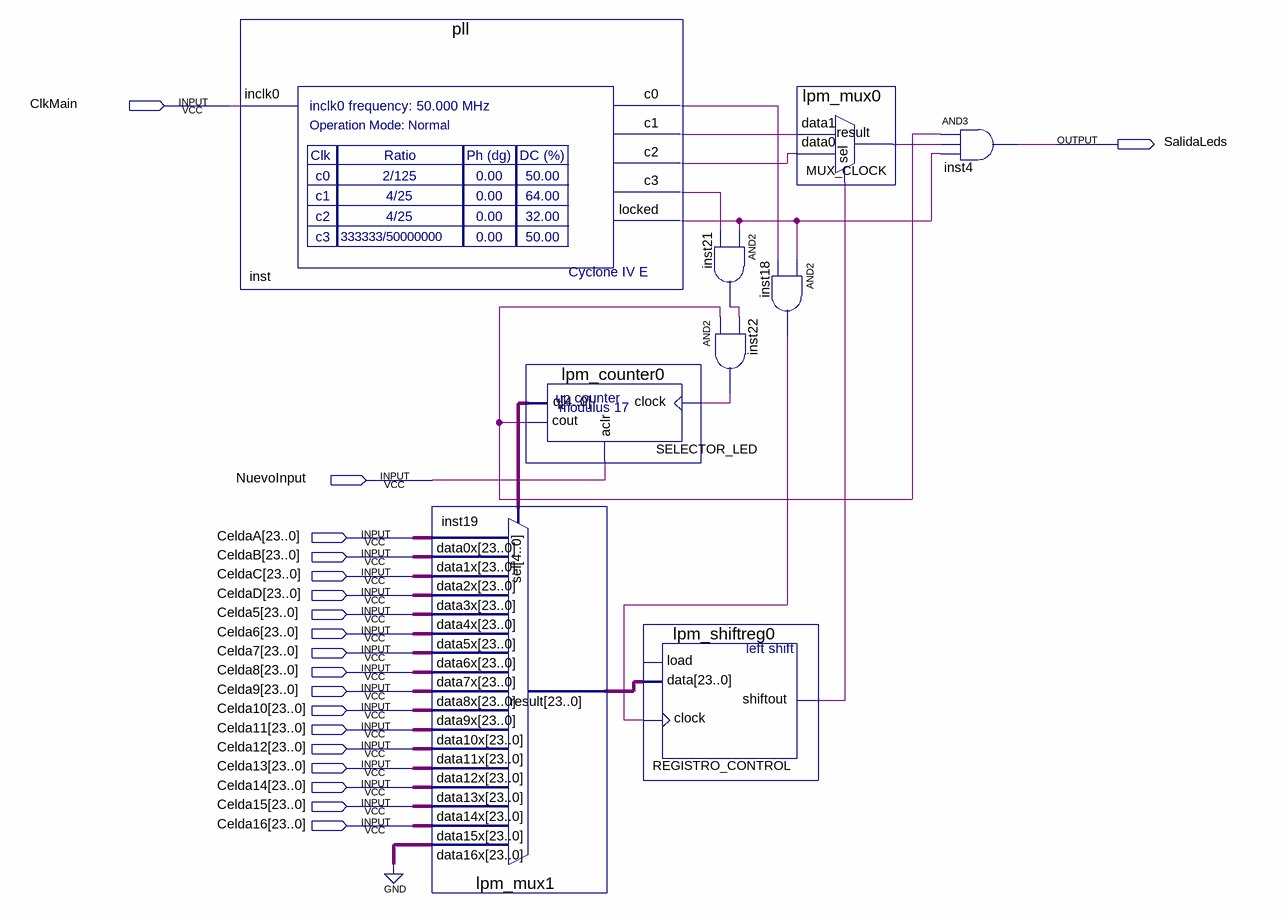
[diagram p0: schematic sheet]
// Quartus schematic OutputLuces.bdf as structural Verilog: 9 symbols, 19 pins
module OutputLuces (
  input  ClkMain,
  input  NuevoInput,
  input  [23:0] CeldaA,
  input  [23:0] CeldaB,
  input  [23:0] CeldaC,
  input  [23:0] CeldaD,
  input  [23:0] Celda5,
  input  [23:0] Celda6,
  input  [23:0] Celda7,
  input  [23:0] Celda8,
  input  [23:0] Celda9,
  input  [23:0] Celda10,
  input  [23:0] Celda11,
  input  [23:0] Celda12,
  input  [23:0] Celda13,
  input  [23:0] Celda14,
  input  [23:0] Celda15,
  input  [23:0] Celda16,
  output SalidaLeds
);

  wire inst18_out, inst21_out, inst22_out, inst_c0, inst_c1, inst_c2, inst_c3, inst_locked, MUX_CLOCK_result,
       REGISTRO_CONTROL_shiftout, SELECTOR_LED_cout;
  wire [4:0] SELECTOR_LED_q;
  wire [23:0] inst19_result;

  pll inst (.inclk0(ClkMain), .c0(inst_c0), .c1(inst_c1), .c2(inst_c2), .c3(inst_c3), .locked(inst_locked));
  lpm_mux1 inst19 (
    .data16x({24{1'b0}}), .data15x(Celda16), .data14x(Celda15), .data13x(Celda14), .data12x(Celda13),
    .data11x(Celda12), .data10x(Celda11), .data9x(Celda10), .data8x(Celda9), .data7x(Celda8),
    .data6x(Celda7), .data5x(Celda6), .data4x(Celda5), .data3x(CeldaD), .data2x(CeldaC), .data1x(CeldaB),
    .data0x(CeldaA), .sel(SELECTOR_LED_q), .result(inst19_result));
  lpm_counter0 SELECTOR_LED (.clock(inst22_out), .aclr(NuevoInput), .cout(SELECTOR_LED_cout), .q(SELECTOR_LED_q));
  lpm_shiftreg0 REGISTRO_CONTROL (
    .data(inst19_result), .clock(inst18_out), .shiftout(REGISTRO_CONTROL_shiftout));  // open: load
  and inst21 (inst21_out, inst_locked, inst_c3);
  and inst18 (inst18_out, inst_locked, inst_c0);
  and inst22 (inst22_out, SELECTOR_LED_cout, inst21_out);
  lpm_mux0 MUX_CLOCK (.data1(inst_c1), .data0(inst_c2), .sel(REGISTRO_CONTROL_shiftout), .result(MUX_CLOCK_result));
  and inst4 (SalidaLeds, SELECTOR_LED_cout, MUX_CLOCK_result, inst_locked);
endmodule
